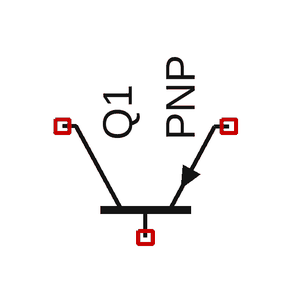
[diagram p0: schematic getProps1.asc]
getProps1.asc, the LTspice schematic file:
Version 4.1
SHEET 1 880 680
SYMBOL pnp 208 176 R270
SYMATTR InstName Q1

The netlist it stands for:
* getProps1.asc
Q1 NC_01 NC_02 NC_03 0 PNP
.model NPN NPN
.model PNP PNP
.lib standard.bjt
.backanno
.end